# Altium schematic sheet IO-LevelShift.SchDoc: =ProjectTitle
size 209 x 297 mm; Scale: 1:1; Address1: Address1; Address2: Address2; Address3: Address3; Address4: Address4; SheetNumber: 10; SheetTotal: 10; DocumentType: Схема электрическая принципиальная
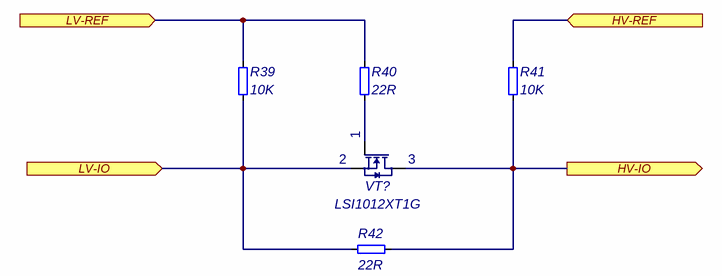
[diagram p0: IO-LevelShift.SchDoc]

## Parts
R39  10K  [R_0402]
R40  22R  [R_0402]
R41  10K  [R_0402]
R42  22R  [R_0402]
VT?  LSI1012XT1G  [SC-89]

## Ports
HV-IO (out), HV-REF (in), LV-IO (in), LV-REF (in)

## Nets
HV-IO: R41.2 R42.2 VT?.3(D) ; port HV-IO
HV-REF: R41.1 ; port HV-REF
LV-IO: R39.2 R42.1 VT?.2(S) ; port LV-IO
LV-REF: R39.1 R40.2 ; port LV-REF
NetR40_1: R40.1 VT?.1(G)

## Notes on the sheet
- Подп. и дата
- Инв. № дубл.
- Взам. инв. №
- Symbol name: =SheetSymbolDesignator
  File name: =DocumentName
  Variant name (Short): =ProjectVariant ( =ProjectBoardVariant )
  Version on board: =ProjectRevisionCode
- Инв. № подл.
- Изм.
- Лист
- № докум.
- Подп.
- Дата
- 2.106-A4
- Копировал
- Формат А4

## Library data of the parts
R39 R41 = 0402-0.0625W-10K-100ppm±1%: NameFromManufacturer: RC0402FR-0710KL; Manufacturer: Yageo; Place: S; Tolerance: 1%; Check: False; Part Number: 0402-0.0625W-10K-100ppm±1%; Value: 10K; Temperature: -55°C~155°C; ComponentLink1Description: DATASHEET; ComponentLink1URL: https://ru.mouser.com/ProductDetail/YAGEO/RC0402FR-0710KL?qs=%2Fha2pyFaduhjtLcYvKXQ8IogF7YwN7YtH%252BOO8ZtEEMnoa4yoWYcwpw%3D%3D; Datasheet: Datasheets/resistors/PYu-RC_Group_51_RoHS_L_11.pdf; Last changed: 27.10.2022
R40 R42 = 0402-0.0625W-22R-100ppm±1%: NameFromManufacturer: RC0402FR-0722RL; Manufacturer: Yageo; Place: S; Tolerance: 1%; Check: False; Part Number: 0402-0.0625W-22R-100ppm±1%; Value: 22R; Temperature: -55°C~155°C; ComponentLink1Description: DATASHEET; ComponentLink1URL: https://www.yageo.com/upload/media/product/productsearch/datasheet/rchip/PYu-RC_Group_51_RoHS_L_11.pdf; Datasheet: Datasheets/resistors/PYu-RC_Group_51_RoHS_L_11.pdf; Last changed: 27.10.2022
VT? = LSI1012XT1G: 20V 500mA 250mW, 900mV@250uA N Channel SC-89 MOSFET; Manufacturer: LRC; Place: T; Check: False; Part Number: LSI1012XT1G; Voltage: 20V; Value: LSI1012XT1G; Temperature: -55°C~150°C; ComponentLink1Description: DATASHEET; NameFromManufacturer: LSI1012XT1G; ComponentLink1URL: https://www.lcsc.com/product-detail/MOSFETs_LRC-LSI1012XT1G_C383275.html; Last changeв: 11.03.2024